# Altium project Receiver Board.PrjPCB
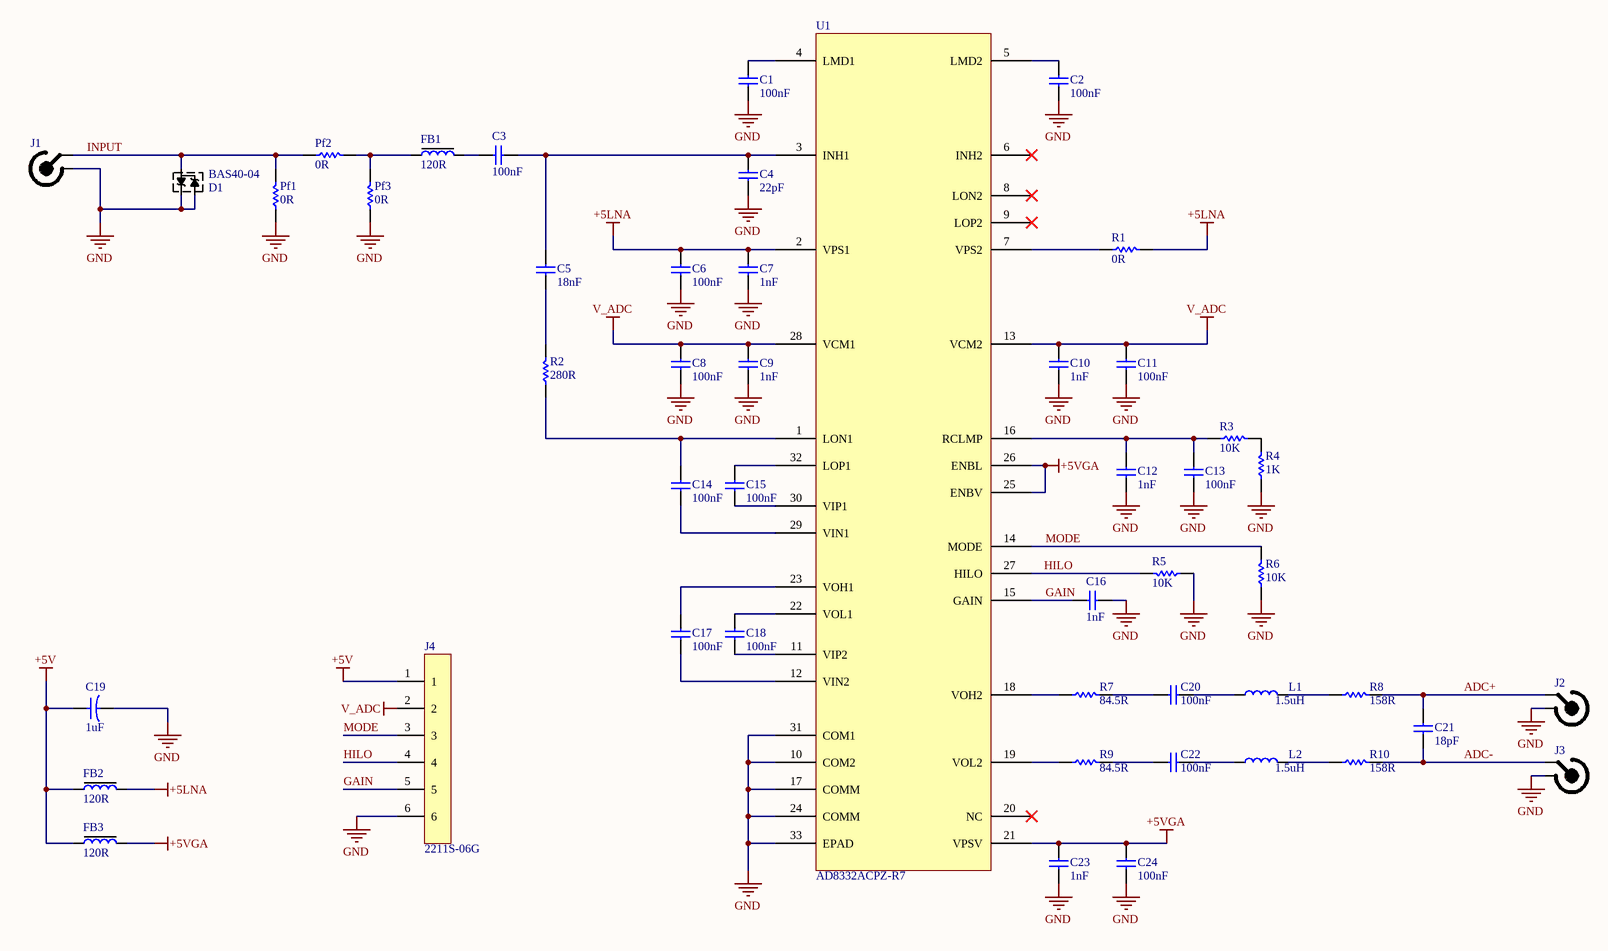
[diagram p0: Receiver.SchDoc]
1 sheet, 48 parts. Net scope: global (net labels, ports and power ports of the same name join across sheets).
Board file: Receiver.PcbDoc

## Sheet Receiver.SchDoc: AD8832 Test Board
size A3; Revision: 1.0; SheetNumber: 1; SheetTotal: 1

### Parts
C1  100nF  [CAP 0603/1608]
C2  100nF  [CAP 0603/1608]
C3  100nF  [CAP 0603/1608]
C4  22pF  [CAP 0603/1608]
C5  18nF  [CAP 0603/1608]
C6  100nF  [CAP 0603/1608]
C7  1nF  [CAP 0603/1608]
C8  100nF  [CAP 0603/1608]
C9  1nF  [CAP 0603/1608]
C10  1nF  [CAP 0603/1608]
C11  100nF  [CAP 0603/1608]
C12  1nF  [CAP 0603/1608]
C13  100nF  [CAP 0603/1608]
C14  100nF  [CAP 0603/1608]
C15  100nF  [CAP 0603/1608]
C16  1nF  [CAP 0603/1608]
C17  100nF  [CAP 0603/1608]
C18  100nF  [CAP 0603/1608]
C19  1uF  [CAP CASE A]
C20  100nF  [CAP 0603/1608]
C21  18pF  [CAP 0603/1608]
C22  100nF  [CAP 0603/1608]
C23  1nF  [CAP 0603/1608]
C24  100nF  [CAP 0603/1608]
D1  BAS40-04  [SOT-23-3]
FB1  120R  [FER 0805/2012]
FB2  120R  [FER 0805/2012]
FB3  120R  [FER 0805/2012]
J1  73251-1150  [73251-1150]  (value not drawn)
J2  73251-1150  [73251-1150]  (value not drawn)
J3  73251-1150  [73251-1150]  (value not drawn)
J4  2211S-06G  [HEADER 6-WAY 2.54 mm]
L1  1.5uH  [FER 0603/1608]
L2  1.5uH  [FER 0603/1608]
Pf1  0R  [RES 1206/3216]
Pf2  0R  [RES 1206/3216]
Pf3  0R  [RES 1206/3216]
R1  0R  [RES 0603/1608]
R2  280R  [RES 0603/1608]
R3  10K  [RES 0603/1608]
R4  1K  [RES 0603/1608]
R5  10K  [RES 0603/1608]
R6  10K  [RES 0603/1608]
R7  84.5R  [RES 0603/1608]
R8  158R  [RES 0603/1608]
R9  84.5R  [RES 0603/1608]
R10  158R  [RES 0603/1608]
U1  AD8332ACPZ-R7  [LFCSP-32]

### Nets
+5LNA: C6.1 C7.2 FB2.2 R1.2 U1.2(VPS1)
+5V: C19.1 FB2.1 FB3.1 J4.1
+5VGA: C23.2 C24.2 FB3.2 U1.21(VPSV) U1.25(ENBV) U1.26(ENBL)
GND: C1.1 C2.1 C4.1 C6.2 C7.1 C8.2 C9.1 C10.1 C11.2 C12.1 C13.1 C16.1 C19.2 C23.1 C24.1 D1.1 D1.2 J1.2 J2.2 J3.2 J4.6 Pf1.1 Pf3.1 R4.1 R5.1 R6.1 U1.10(COM2) U1.17(COMM) U1.24(COMM) U1.31(COM1) U1.33(EPAD)
V_ADC: C8.1 C9.2 C10.2 C11.1 J4.2 U1.13(VCM2) U1.28(VCM1)
ADC+: C21.2 J2.1 R8.2
ADC-: C21.1 J3.1 R10.2
GAIN: C16.2 J4.5 U1.15(GAIN)
HILO: J4.4 R5.2 U1.27(HILO)
INPUT: D1.3 J1.1 Pf1.2 Pf2.1
MODE: J4.3 R6.2 U1.14(MODE)
NetC1_2: C1.2 U1.4(LMD1)
NetC2_2: C2.2 U1.5(LMD2)
NetC3_1: C3.1 FB1.2
NetC3_2: C3.2 C4.2 C5.2 U1.3(INH1)
NetC5_1: C5.1 R2.2
NetC12_2: C12.2 C13.2 R3.1 U1.16(RCLMP)
NetC14_1: C14.1 U1.29(VIN1)
NetC14_2: C14.2 R2.1 U1.1(LON1)
NetC15_1: C15.1 U1.30(VIP1)
NetC15_2: C15.2 U1.32(LOP1)
NetC17_1: C17.1 U1.12(VIN2)
NetC17_2: C17.2 U1.23(VOH1)
NetC18_1: C18.1 U1.11(VIP2)
NetC18_2: C18.2 U1.22(VOL1)
NetC20_1: C20.1 R7.2
NetC20_2: C20.2 L1.1
NetC22_1: C22.1 R9.2
NetC22_2: C22.2 L2.1
NetFB1_1: FB1.1 Pf2.2 Pf3.2
NetL1_2: L1.2 R8.1
NetL2_2: L2.2 R10.1
NetR1_1: R1.1 U1.7(VPS2)
NetR3_2: R3.2 R4.2
NetR7_1: R7.1 U1.18(VOH2)
NetR9_1: R9.1 U1.19(VOL2)

Not connected (* = marked no-connect by the designer): U1 6(INH2)* 8(LON2)* 9(LOP2)* 20(NC)*

### Notes on the sheet
- Title:
- Size:
- Date:
- A4
- Revision:
- Sheet
- of
- File:

### Library data of the parts
C1-C3 C6 C8 C11 C13-C15 C17 C18 C20 C22 C24 = GCJ188R71H104KA12D: CAPACITOR 0603 100nF 10% 50V; Manufacturer: Murata; Dielectric: X7R; Supplier 1: Farnell; Manufacturer Part Number: GCJ188R71H104KA12D; Stock 1: 0; Pricing 1: 150=0.11, 500=0.066, 1000=0.055 (EUR); Mount: Surface Mount; Case/Package: 0603; Case Code (Metric): 1608; Case Code (Imperial): 0603; Min Operating Temperature: -55°C; Max Operating Temperature: 125°C; Capacitance: 100nF; Tolerance: 10%; Package Quantity: 1; Voltage Rating: 50V; Packaging: Tape and Reel; Voltage Rating (DC): 50V; Termination: SMD/SMT; Features: Soft Termination; Length: 1.6mm; Height: 0.8mm; Width: 0.031inch; Thickness: 0.035inch; Depth: 0.8mm; Ratings: AEC-Q200; Radiation Hardening: No; Lead Free: Lead Free; ComponentLink1URL: http://search.murata.co.jp/Ceramy/image/img/A01X/partnumbering_e_02.pdf?src-supplier=Digi-Key; ComponentLink1Description: http://search.murata.co.jp/Ceramy/image/img/A01X/partnumbering_e_02.pdf?src-supplier=Digi-Key; ComponentLink2URL: http://www.murata.com/products/catalog/pdf/c03e.pdf?src-supplier=Future+Electronics; ComponentLink2Description: http://www.murata.com/products/catalog/pdf/c03e.pdf?src-supplier=Future+Electronics; ComponentLink3URL: https://www.verical.com/server-webapp/html/getDatasheet?partID=369886&src-supplier=Verical; ComponentLink3Description: https://www.verical.com/server-webapp/html/getDatasheet?partID=369886&src-supplier=Verical
C4 = C1608C0G1H220J080AA: CAPACITOR 0603 22 pF 50 V  5%, C0G / NP0; Manufacturer: TDK; Dielectric Material: Ceramic; Voltage Rating: 50V; Temperature Coefficient: 30ppm/°C; Supplier 1: Farnell; Manufacturer Part Number: C1608C0G1H220J080AA; Stock 1: 0; Mount: Surface Mount; Case/Package: 0603; Number of Pins: 2; Case Code (Metric): 1608; Case Code (Imperial): 0603; Weight: 7.1E-05oz; Min Operating Temperature: -55°C; Max Operating Temperature: 125°C; Tolerance: 5%; Capacitance: 22pF; Dielectric: C0G; Packaging: Tape and Reel; Package Quantity: 1; Voltage Rating (DC): 50V; Termination: SMD/SMT; Voltage: 50V; Length: 1.6mm; Width: 0.031inch; Height: 0.8mm; Depth: 0.8mm; Thickness: 0.037inch; Radiation Hardening: No; REACH SVHC: Unknown; Lead Free: Lead Free; ComponentLink1URL: https://product.tdk.com/info/en/documents/chara_sheet/C1608C0G1H220J080AA.pdf?src-supplier=Digi-Key; ComponentLink1Description: https://product.tdk.com/info/en/documents/chara_sheet/C1608C0G1H220J080AA.pdf?src-supplier=Digi-Key; ComponentLink2URL: http://www.tdk.co.jp/tefe02/e412_c.pdf?src-supplier=Avnet+Europe; ComponentLink2Description: http://www.tdk.co.jp/tefe02/e412_c.pdf?src-supplier=Avnet+Europe; ComponentLink3URL: http://www.farnell.com/datasheets/1796654.pdf?src-supplier=Element14; ComponentLink3Description: http://www.farnell.com/datasheets/1796654.pdf?src-supplier=Element14; ComponentLink4URL: http://www.farnell.com/datasheets/1744655.pdf?src-supplier=Element14; ComponentLink4Description: http://www.farnell.com/datasheets/1744655.pdf?src-supplier=Element14; ComponentLink5URL: http://www.farnell.com/datasheets/1913358.pdf?src-supplier=Element14; ComponentLink5Description: http://www.farnell.com/datasheets/1913358.pdf?src-supplier=Element14; ComponentLink6URL: http://www.farnell.com/datasheets/2291921.pdf?src-supplier=Verical; ComponentLink6Description: http://www.farnell.com/datasheets/2291921.pdf?src-supplier=Verical
C5 = C1608C0G1V183J080AC: CAPACITOR 0603 18nF 35V NP0; Manufacturer: TDK; Dielectric Material: Ceramic; Tolerance: 5%; Supplier 1: Farnell; Manufacturer Part Number: C1608C0G1V183J080AC; Stock 1: 0; Pricing 1: 150=0.127, 500=0.0919, 1000=0.0807, 2000=0.0669, 4000=0.0576, 20000=0.0502 (EUR); Mount: Surface Mount; Case/Package: 0603; Case Code (Metric): 1608; Case Code (Imperial): 0603; Min Operating Temperature: -55°C; Max Operating Temperature: 125°C; Packaging: Tape and Reel; Capacitance: 18nF; Voltage Rating: 35V; Voltage Rating (DC): 35V; Length: 0.063inch; Width: 0.031inch; Thickness: 0.035inch; Lead Free: Lead Free; ComponentLink1URL: https://product.tdk.com/info/en/catalog/spec/mlccspec_commercial_general_midvoltage_en.pdf?src-supplier=Digi-Key; ComponentLink1Description: https://product.tdk.com/info/en/catalog/spec/mlccspec_commercial_general_midvoltage_en.pdf?src-supplier=Digi-Key
C7 C9 C10 C12 C16 C23 = GRM1885C2A102JA01D: CAPACITOR 0603 1nF 100V C0G/NP0; Manufacturer: Murata; Material: Ceramic; Tolerance: 5%; Dielectric: C0G; Temperature Coefficient: 30ppm/°C; Supplier 1: Farnell; Manufacturer Part Number: GRM1885C2A102JA01D; Stock 1: 0; Pricing 1: 4000=0.0144, 20000=0.0141 (EUR); Mount: Surface Mount; Case/Package: 0603; Case Code (Imperial): 0603; Case Code (Metric): 1608; Min Operating Temperature: -55°C; Max Operating Temperature: 125°C; Capacitance: 1nF; Packaging: Tape and Reel; Voltage Rating: 100V; Package Quantity: 1; Termination: SMD/SMT; Voltage: 100V; Voltage Rating (DC): 100V; Length: 1.6mm; Width: 0.031inch; Height: 0.8mm; Thickness: 0.035inch; Depth: 0.8mm; Radiation Hardening: No; REACH SVHC: No SVHC; Lead Free: Lead Free; ComponentLink1URL: http://psearch.murata.com/capacitor/product/GRM1885C2A102JA01%23.pdf?src-supplier=Future+Electronics; ComponentLink1Description: http://psearch.murata.com/capacitor/product/GRM1885C2A102JA01%23.pdf?src-supplier=Future+Electronics; ComponentLink2URL: http://components.arrow.com/part/dataview/41890575S7256258N2606?src-supplier=Arrow+Electronics; ComponentLink2Description: http://components.arrow.com/part/dataview/41890575S7256258N2606?src-supplier=Arrow+Electronics; ComponentLink3URL: http://www.mouser.com/ds/2/281/c02e-2905.pdf?src-supplier=Mouser; ComponentLink3Description: http://www.mouser.com/ds/2/281/c02e-2905.pdf?src-supplier=Mouser; ComponentLink4URL: https://www.murata.com/~/media/webrenewal/support/library/catalog/products/capacitor/mlcc/c02e.ashx?la=en-us&src-supplier=Digi-Key; ComponentLink4Description: https://www.murata.com/~/media/webrenewal/support/library/catalog/products/capacitor/mlcc/c02e.ashx?la=en-us&src-supplier=Digi-Key; ComponentLink5URL: https://produktinfo.conrad.com/datenblaetter/450000-474999/451233-da-01-en-VS_KONDENSATOR_0603.pdf?src-supplier=Conrad; ComponentLink5Description: https://produktinfo.conrad.com/datenblaetter/450000-474999/451233-da-01-en-VS_KONDENSATOR_0603.pdf?src-supplier=Conrad
C19 = T491A105K016AT: CAPACITOR TANT 1uF 16V; Manufacturer: KEMET; Dielectric Material: Tantalum; Tolerance: 20%; ESR (Equivalent Series Resistance): 10R; Polarity: Polar; Dissipation Factor: 4%; Life (Hours): 2000Hour; Leakage Current: 500nA; Ripple Current: 87mA; Supplier 1: Farnell; Manufacturer Part Number: T491A105K016AT; Stock 1: 0; Mount: Surface Mount,PCB; Case/Package: 1206; Number of Pins: 2; Case Code (Imperial): 1206; Case Code (Metric): 3216; Min Operating Temperature: -55°C; Max Operating Temperature: 125°C; Capacitance: 1uF; Packaging: Tape and Reel; Voltage Rating: 16V; Package Quantity: 1; Features: General Purpose; Voltage Rating (DC): 16V; Termination: SMD/SMT; Voltage: 16V; Length: 3.2mm; Width: 1.6mm; Height: 1.6mm; Depth: 1.6mm; Height - Seated (Max): 0.071inch; REACH SVHC: No SVHC; Lead Free: Lead Free; ComponentLink1URL: https://4donline.ihs.com/images/VipMasterIC/IC/KEME/KEME-S-A0006487387/KEME-S-A0006487387-1.pdf?hkey=52A5661711E402568146F3353EA87419&src-supplier=Element14; ComponentLink1Description: https://4donline.ihs.com/images/VipMasterIC/IC/KEME/KEME-S-A0006487387/KEME-S-A0006487387-1.pdf?hkey=52A5661711E402568146F3353EA87419&src-supplier=Element14; ComponentLink2URL: http://www.rapidonline.com/pdf/458280_da_en_01.pdf?src-supplier=Rapid+Electronics; ComponentLink2Description: http://www.rapidonline.com/pdf/458280_da_en_01.pdf?src-supplier=Rapid+Electronics; ComponentLink3URL: http://www.jameco.com/Jameco/Products/ProdDS/1573169.pdf?src-supplier=Jameco; ComponentLink3Description: http://www.jameco.com/Jameco/Products/ProdDS/1573169.pdf?src-supplier=Jameco; ComponentLink4URL: http://www.kemet.com/kemet/web/homepage/kechome.nsf/file/T491%20Series/$file/KEM_T2005_T491.pdf?src-supplier=Farnell; ComponentLink4Description: http://www.kemet.com/kemet/web/homepage/kechome.nsf/file/T491%20Series/$file/KEM_T2005_T491.pdf?src-supplier=Farnell; ComponentLink5URL: http://www.mouser.com/ds/2/212/KEM_T2005_T491-1093550.pdf?src-supplier=Mouser; ComponentLink5Description: http://www.mouser.com/ds/2/212/KEM_T2005_T491-1093550.pdf?src-supplier=Mouser; ComponentLink6URL: https://www.distrelec.biz/Web/Downloads/_t/ds/KEM_T2005_T491_eng_tds.pdf?mime=application%2Fpdf&src-supplier=Distrelec; ComponentLink6Description: https://www.distrelec.biz/Web/Downloads/_t/ds/KEM_T2005_T491_eng_tds.pdf?mime=application%2Fpdf&src-supplier=Distrelec; ComponentLink7URL: https://api.kemet.com/component-edge/download/datasheet/T491A105K016AT.pdf?src-supplier=Digi-Key; ComponentLink7Description: https://api.kemet.com/component-edge/download/datasheet/T491A105K016AT.pdf?src-supplier=Digi-Key; ComponentLink8URL: http://www.kemet.com/kemet/web/homepage/kechome.nsf/file/T491%20Series/$file/KEM_T2005_T491.pdf?src-supplier=Element14; ComponentLink8Description: http://www.kemet.com/kemet/web/homepage/kechome.nsf/file/T491%20Series/$file/KEM_T2005_T491.pdf?src-supplier=Element14; ComponentLink9URL: http://uk.rs-online.com/webdocs/1529/0900766b815290c9.pdf?src-supplier=RSComponents; ComponentLink9Description: http://uk.rs-online.com/webdocs/1529/0900766b815290c9.pdf?src-supplier=RSComponents; ComponentLink10URL: https://www.alliedelec.com/m/d/1172a60f7bb3eb66344f86e8fb9ddbde.pdf?src-supplier=Allied+Electronics; ComponentLink10Description: https://www.alliedelec.com/m/d/1172a60f7bb3eb66344f86e8fb9ddbde.pdf?src-supplier=Allied+Electronics
C21 = C1608C0G1H180J080AA: CAPACITOR 0603 18pF 50V C0G; Manufacturer: TDK; Dielectric Material: Ceramic; Tolerance: 5%; Temperature Coefficient: 30ppm/°C; Supplier 1: Farnell; Manufacturer Part Number: C1608C0G1H180J080AA; Stock 1: 0; Mount: Surface Mount; Case/Package: 0603; Number of Pins: 2; Case Code (Metric): 1608; Case Code (Imperial): 0603; Weight: 7.1E-05oz; Min Operating Temperature: -55°C; Max Operating Temperature: 125°C; Capacitance: 18pF; Dielectric: C0G; Voltage Rating: 50V; Package Quantity: 1; Packaging: Tape and Reel; Voltage Rating (DC): 50V; Termination: SMD/SMT; Voltage: 50V; Length: 1.6mm; Width: 0.031inch; Height: 0.8mm; Depth: 0.8mm; Thickness: 0.037inch; Radiation Hardening: No; REACH SVHC: No SVHC; Lead Free: Lead Free; ComponentLink1URL: http://www.farnell.com/datasheets/1796654.pdf?src-supplier=Element14; ComponentLink1Description: http://www.farnell.com/datasheets/1796654.pdf?src-supplier=Element14; ComponentLink2URL: http://www.farnell.com/datasheets/1571323.pdf?src-supplier=Element14; ComponentLink2Description: http://www.farnell.com/datasheets/1571323.pdf?src-supplier=Element14; ComponentLink3URL: http://www.farnell.com/datasheets/1571323.pdf?src-supplier=Farnell; ComponentLink3Description: http://www.farnell.com/datasheets/1571323.pdf?src-supplier=Farnell; ComponentLink4URL: http://www.farnell.com/datasheets/1744655.pdf?src-supplier=Element14; ComponentLink4Description: http://www.farnell.com/datasheets/1744655.pdf?src-supplier=Element14; ComponentLink5URL: https://product.tdk.com/info/en/documents/chara_sheet/C1608C0G1H180J080AA.pdf?src-supplier=Digi-Key; ComponentLink5Description: https://product.tdk.com/info/en/documents/chara_sheet/C1608C0G1H180J080AA.pdf?src-supplier=Digi-Key; ComponentLink6URL: http://www.tdk.co.jp/tefe02/e412_c.pdf?src-supplier=Avnet+Europe; ComponentLink6Description: http://www.tdk.co.jp/tefe02/e412_c.pdf?src-supplier=Avnet+Europe
D1 = BAS40-04: SCHOTTKY DIODE; Manufacturer: Infineon; Forward Current: 120mA; Max Repetitive Reverse Voltage (Vrrm): 40V; Forward Voltage: 380mV; Max Forward Surge Current (Ifsm): 200mA; Element Configuration: Dual; Supplier 1: Farnell; Manufacturer Part Number: BAS40-04; Stock 1: 0; Case/Package: SOT; Number of Pins: 3; Min Operating Temperature: -55°C; Max Operating Temperature: 125°C; Packaging: Tape and Reel; Termination: SMD/SMT; REACH SVHC: No SVHC; ComponentLink1URL: https://www.distrelec.biz/Web/Downloads/ta/_e/srBAS40_data_e.pdf?mime=application%2Fpdf&src-supplier=Distrelec; ComponentLink1Description: https://www.distrelec.biz/Web/Downloads/ta/_e/srBAS40_data_e.pdf?mime=application%2Fpdf&src-supplier=Distrelec
FB1-FB3 = BLM21PG121SN1D: FERRITE BEAD 120Ohm 3A; Manufacturer: Murata; Material: Steel,Ferrite; DC Resistance (DCR): 30mR; Number of Lines: 1; Tolerance: 25%; Test Frequency: 100MHz; Supplier 1: Farnell; Manufacturer Part Number: BLM21PG121SN1D; Stock 1: 0; Case/Package: 0805; Number of Pins: 2; Case Code (Metric): 2012; Case Code (Imperial): 0805; Min Operating Temperature: -55°C; Max Operating Temperature: 125°C; Impedance: 120R; Packaging: Tape and Reel; Current Rating: 3A; Number of Circuits: 1; Package Quantity: 1; Max Current Rating: 3A; Max DC Current: 3A; Termination: SMD/SMT; Length: 2mm; Height: 0.85mm; Width: 1.25mm; Depth: 1.25mm; REACH SVHC: No SVHC; Lead Free: Lead Free; ComponentLink1URL: http://search.murata.co.jp/Ceramy/image/img/PDF/ENG/L0110S0100BLM21P.pdf?src-supplier=Future+Electronics; ComponentLink1Description: http://search.murata.co.jp/Ceramy/image/img/PDF/ENG/L0110S0100BLM21P.pdf?src-supplier=Future+Electronics; ComponentLink2URL: https://www.murata.com/en-us/products/productdata/8796738977822/ENFA0005.pdf?src-supplier=Digi-Key; ComponentLink2Description: https://www.murata.com/en-us/products/productdata/8796738977822/ENFA0005.pdf?src-supplier=Digi-Key; ComponentLink3URL: http://www.farnell.com/datasheets/1756152.pdf?src-supplier=Element14; ComponentLink3Description: http://www.farnell.com/datasheets/1756152.pdf?src-supplier=Element14
J1-J3 = 73251-1150: CONN SMA RCPT STR 50OHM EDGE MNT; Manufacturer: Molex; Body Material: Brass; Body Plating: Gold; Dielectric Material: PTFE; Impedance: 50R; Connector Type: SMA,Socket; Max Frequency: 18GHz; Voltage Rating: 500V; Supplier 1: Farnell; Manufacturer Part Number: 73251-1150; Stock 1: 0; Mount: Edge; Case/Package: SMA; Contact Plating: Gold; Contact Material: Copper; Insulation Material: Polytetrafluoroethylene; Housing Color: Gold; Min Operating Temperature: -65°C; Max Operating Temperature: 165°C; Termination: Solder; Packaging: Tray; Package Quantity: 1600; Fastening Type: Threaded; Length: 9.53mm; Depth: 9.53mm; Radiation Hardening: No; Lead Free: Lead Free; ComponentLink1URL: http://www.farnell.com/datasheets/1596721.pdf?src-supplier=Farnell; ComponentLink1Description: http://www.farnell.com/datasheets/1596721.pdf?src-supplier=Farnell; ComponentLink2URL: http://www.molex.com/webdocs/datasheets/pdf/en-us/0732511150_RF_COAX_CONNECTORS.pdf?src-supplier=Avnet; ComponentLink2Description: http://www.molex.com/webdocs/datasheets/pdf/en-us/0732511150_RF_COAX_CONNECTORS.pdf?src-supplier=Avnet; ComponentLink3URL: https://www.molex.com/pdm_docs/ps/PS-89675-346.pdf?src-supplier=Digi-Key; ComponentLink3Description: https://www.molex.com/pdm_docs/ps/PS-89675-346.pdf?src-supplier=Digi-Key; ComponentLink4URL: http://www.onlinecomponents.com/productFiles/mf-MOL/473370732511150_rf_coax_nectors.pdf?src-supplier=Onlinecomponents.com; ComponentLink4Description: http://www.onlinecomponents.com/productFiles/mf-MOL/473370732511150_rf_coax_nectors.pdf?src-supplier=Onlinecomponents.com; ComponentLink5URL: http://www.farnell.com/datasheets/1596721.pdf?src-supplier=Element14; ComponentLink5Description: http://www.farnell.com/datasheets/1596721.pdf?src-supplier=Element14; ComponentLink6URL: http://uk.rs-online.com/webdocs/13c4/0900766b813c49cf.pdf?src-supplier=RSComponents; ComponentLink6Description: http://uk.rs-online.com/webdocs/13c4/0900766b813c49cf.pdf?src-supplier=RSComponents
J4 = 2211S-06G: HEADER 6-Way 2.54mm TH; Manufacturer: Multicomp; Number of Contacts: 6; Gender: Male; Insulation Resistance: 1GR; Supplier 1: Farnell; Manufacturer Part Number: 2211S-06G; Stock 1: 35965; Pricing 1: 50=0.0344, 500=0.0253, 1500=0.0218, 2500=0.0179 (EUR); Mount: Through Hole; Contact Plating: Gold; Contact Material: Copper Alloy; Weight: 0.11lb; Number of Rows: 1; Termination: Through Hole; Length: 0.59inch; Width: 0.12inch; Height: 0.47inch; Flammability Rating: UL94 V-0; REACH SVHC: No SVHC; ComponentLink1URL: http://www.farnell.com/datasheets/1518407.pdf?src-supplier=Element14; ComponentLink1Description: http://www.farnell.com/datasheets/1518407.pdf?src-supplier=Element14
L1 L2 = MLF1608A1R5K: INDUCTOR 0603 1.5uH 10%; Manufacturer: TDK; Core Material: Ferrite; Max DC Current: 50mA; DC Resistance (DCR): 700mR; Self Resonant Frequency: 100MHz; Shielding: Shielded; Test Frequency: 10MHz; Q Factor: 35; Supplier 1: Farnell; Manufacturer Part Number: MLF1608A1R5K; Stock 1: 0; Pricing 1: 150=0.141, 500=0.0877, 1000=0.0765, 2000=0.075, 4000=0.0735, 20000=0.072 (EUR); Mount: Surface Mount; Case/Package: 0603; Number of Pins: 2; Case Code (Metric): 1608; Case Code (Imperial): 0603; Weight: 0.000141oz; Min Operating Temperature: -40°C; Max Operating Temperature: 85°C; Tolerance: 10%; Inductance: 1.5uH; Packaging: Tape and Reel; Package Quantity: 4000; Current Rating: 50mA; Termination: SMD/SMT; DC Current: 50mA; Inductance Tolerance: 10%; Length: 0.063inch; Width: 0.8mm; Height: 0.8mm; Depth: 0.95mm; Military Standard: Not; REACH SVHC: No SVHC; Lead Free: Lead Free; ComponentLink1URL: http://www.farnell.com/datasheets/321058.pdf?src-supplier=Element14; ComponentLink1Description: http://www.farnell.com/datasheets/321058.pdf?src-supplier=Element14
Pf1-Pf3 = ERJ8GEY0R00V: RESISTOR 1206 0R; Manufacturer: Panasonic; Power Rating: 250mW; Voltage Rating: 200V; Tolerance: 0.05%; Temperature Coefficient: 600ppm/°C; Supplier 1: Farnell; Manufacturer Part Number: ERJ8GEY0R00V; Stock 1: 0; Mount: Surface Mount; Case/Package: 1206; Contact Plating: Tin; Case Code (Metric): 3216; Case Code (Imperial): 1206; Min Operating Temperature: -55°C; Max Operating Temperature: 155°C; Resistance: 0R; Resistor Type: Thick Film; Packaging: Tape and Reel; Voltage Rating (DC): 200V; Package Quantity: 5000; Number of Terminations: 2; Termination: SMD/SMT; Max Power Dissipation: 250mW; Features: Automotive AEC-Q200; Length: 3.2mm; Width: 0.063inch; Height: 0.028inch; Depth: 1.6mm; Radiation Hardening: No; REACH SVHC: No SVHC; Military Standard: Not; Lead Free: Lead Free; ComponentLink1URL: http://industrial.panasonic.com/cdbs/www-data/pdf/RDA0000/AOA0000C301.pdf?src-supplier=Element14; ComponentLink1Description: http://industrial.panasonic.com/cdbs/www-data/pdf/RDA0000/AOA0000C301.pdf?src-supplier=Element14; ComponentLink2URL: http://www.farnell.com/datasheets/1678796.pdf?src-supplier=Element14; ComponentLink2Description: http://www.farnell.com/datasheets/1678796.pdf?src-supplier=Element14; ComponentLink3URL: http://www.jameco.com/Jameco/Products/ProdDS/1990261.pdf?src-supplier=Jameco; ComponentLink3Description: http://www.jameco.com/Jameco/Products/ProdDS/1990261.pdf?src-supplier=Jameco; ComponentLink4URL: http://industrial.panasonic.com/www-data/pdf/AOA0000/AOA0000CE1.pdf?src-supplier=Future+Electronics; ComponentLink4Description: http://industrial.panasonic.com/www-data/pdf/AOA0000/AOA0000CE1.pdf?src-supplier=Future+Electronics
R1 = ERJ3GEY0R00V: RESISTOR 0603 0R; Manufacturer: Panasonic; Manufacturer Part Number: ERJ-3GEY0R00V; Power Rating: 100mW; Voltage Rating: 75V; Tolerance: 0%; Temperature Coefficient: 600ppm/°C; Voltage Rating (DC): 50V; Supplier 1: Farnell; Stock 1: 0; Mount: Surface Mount; Case/Package: 0603; Contact Plating: Tin; Case Code (Metric): 1608; Case Code (Imperial): 0603; Min Operating Temperature: -55°C; Max Operating Temperature: 155°C; Resistance: 0R; Resistor Type: Thick Film; Packaging: Tape and Reel; Package Quantity: 1; Number of Terminations: 2; Termination: SMD/SMT; Max Power Dissipation: 100mW; Features: Automotive AEC-Q200; Length: 1.6mm; Width: 0.031inch; Height: 0.45mm; Depth: 0.8mm; Radiation Hardening: No; REACH SVHC: No SVHC; Military Standard: Not; Lead Free: Lead Free; ComponentLink1URL: http://industrial.panasonic.com/www-data/pdf/AOA0000/AOA0000CE1.pdf?src-supplier=Avnet; ComponentLink1Description: http://industrial.panasonic.com/www-data/pdf/AOA0000/AOA0000CE1.pdf?src-supplier=Avnet; ComponentLink2URL: http://industrial.panasonic.com/cdbs/www-data/pdf/RDA0000/AOA0000C301.pdf?src-supplier=Farnell; ComponentLink2Description: http://industrial.panasonic.com/cdbs/www-data/pdf/RDA0000/AOA0000C301.pdf?src-supplier=Farnell; ComponentLink3URL: http://www.jameco.com/Jameco/Products/ProdDS/1935748.pdf?src-supplier=Jameco; ComponentLink3Description: http://www.jameco.com/Jameco/Products/ProdDS/1935748.pdf?src-supplier=Jameco; ComponentLink4URL: http://www.farnell.com/datasheets/1678796.pdf?src-supplier=Element14; ComponentLink4Description: http://www.farnell.com/datasheets/1678796.pdf?src-supplier=Element14; ComponentLink5URL: http://industrial.panasonic.com/www-data/pdf/AOA0000/AOA0000CE1.pdf?src-supplier=Future+Electronics; ComponentLink5Description: http://industrial.panasonic.com/www-data/pdf/AOA0000/AOA0000CE1.pdf?src-supplier=Future+Electronics; ComponentLink6URL: http://industrial.panasonic.com/www-data/pdf/AOA0000/AOA0000CE1.pdf?src-supplier=Avnet+Europe; ComponentLink6Description: http://industrial.panasonic.com/www-data/pdf/AOA0000/AOA0000CE1.pdf?src-supplier=Avnet+Europe; ComponentLink7URL: http://www.alliedelec.com/m/d/51cd0790071e1666bdb9d00c57fcf960.pdf?src-supplier=Allied+Electronics; ComponentLink7Description: http://www.alliedelec.com/m/d/51cd0790071e1666bdb9d00c57fcf960.pdf?src-supplier=Allied+Electronics
R2 = ERJ3EKF2800V: RESISTOR 0603 280R 1%; Manufacturer: Panasonic; Manufacturer Part Number: ERJ-3EKF2800V; Power Rating: 100mW; Voltage Rating: 75V; Temperature Coefficient: 100ppm/°C; Voltage Rating (DC): 50V; Supplier 1: Farnell; Stock 1: 0; Mount: Surface Mount; Case/Package: 0603; Case Code (Metric): 1608; Case Code (Imperial): 0603; Weight: 7.1E-05oz; Contact Plating: Tin; Min Operating Temperature: -55°C; Max Operating Temperature: 155°C; Resistance: 280R; Tolerance: 1%; Packaging: Cut Tape; Package Quantity: 1; Resistor Type: Thick Film; Number of Terminations: 2; Termination: SMD/SMT; Max Power Dissipation: 100mW; Features: Automotive AEC-Q200; Length: 1.6mm; Width: 0.031inch; Height: 0.45mm; Depth: 0.8mm; Radiation Hardening: No; REACH SVHC: No SVHC; Military Standard: Not; Lead Free: Lead Free; ComponentLink1URL: http://www.mouser.com/ds/2/315/AOA0000C304-1149620.pdf?src-supplier=Mouser; ComponentLink1Description: http://www.mouser.com/ds/2/315/AOA0000C304-1149620.pdf?src-supplier=Mouser; ComponentLink2URL: http://www.farnell.com/datasheets/1911175.pdf?src-supplier=Farnell; ComponentLink2Description: http://www.farnell.com/datasheets/1911175.pdf?src-supplier=Farnell; ComponentLink3URL: http://industrial.panasonic.com/www-data/pdf/AOA0000/AOA0000CE2.pdf?src-supplier=Avnet; ComponentLink3Description: http://industrial.panasonic.com/www-data/pdf/AOA0000/AOA0000CE2.pdf?src-supplier=Avnet; ComponentLink4URL: https://www.alliedelec.com/m/d/623f45ff1957d936ff56d46fd1c28cac.pdf?src-supplier=Allied+Electronics; ComponentLink4Description: https://www.alliedelec.com/m/d/623f45ff1957d936ff56d46fd1c28cac.pdf?src-supplier=Allied+Electronics; ComponentLink5URL: http://www.farnell.com/datasheets/1678782.pdf?src-supplier=Element14; ComponentLink5Description: http://www.farnell.com/datasheets/1678782.pdf?src-supplier=Element14; ComponentLink6URL: http://www.farnell.com/datasheets/1911175.pdf?src-supplier=Element14; ComponentLink6Description: http://www.farnell.com/datasheets/1911175.pdf?src-supplier=Element14
R3 R5 R6 = ERJ3EKF1002V: RESISTOR 0603 10K 1%; Manufacturer: Panasonic; Temperature Coefficient: 100ppm/°C; Power Rating: 100mW; Voltage Rating: 75V; Supplier 1: Farnell; Manufacturer Part Number: ERJ3EKF1002V; Stock 1: 0; Mount: Surface Mount; Case/Package: 0603; Number of Pins: 2; Contact Plating: Tin; Case Code (Metric): 1608; Case Code (Imperial): 0603; Min Operating Temperature: -55°C; Max Operating Temperature: 155°C; Resistance: 10K; Tolerance: 1%; Composition: Thick Film; Packaging: Tape and Reel; Package Quantity: 1; Number of Terminations: 2; Termination: SMD/SMT; Military Standard: Not; Max Power Dissipation: 100mW; Voltage Rating (DC): 75V; Features: Automotive AEC-Q200; Length: 1.6mm; Height: 0.45mm; Width: 0.031inch; Depth: 0.8mm; Radiation Hardening: No; REACH SVHC: No SVHC; Lead Free: Lead Free; ComponentLink1URL: https://industrial.panasonic.com/cdbs/www-data/pdf/RDA0000/DMA0000COL11.pdf?src-supplier=Avnet+Asia; ComponentLink1Description: https://industrial.panasonic.com/cdbs/www-data/pdf/RDA0000/DMA0000COL11.pdf?src-supplier=Avnet+Asia; ComponentLink2URL: http://www.farnell.com/datasheets/1911175.pdf?src-supplier=Element14; ComponentLink2Description: http://www.farnell.com/datasheets/1911175.pdf?src-supplier=Element14; ComponentLink3URL: https://industrial.panasonic.com/cdbs/www-data/pdf/RDA0000/DMA0000COL11.pdf?src-supplier=Avnet; ComponentLink3Description: https://industrial.panasonic.com/cdbs/www-data/pdf/RDA0000/DMA0000COL11.pdf?src-supplier=Avnet; ComponentLink4URL: http://industrial.panasonic.com/www-data/pdf/AOA0000/AOA0000CE2.pdf?src-supplier=Avnet+Europe; ComponentLink4Description: http://industrial.panasonic.com/www-data/pdf/AOA0000/AOA0000CE2.pdf?src-supplier=Avnet+Europe; ComponentLink5URL: http://industrial.panasonic.com/www-data/pdf/AOA0000/AOA0000CE2.pdf?src-supplier=Avnet; ComponentLink5Description: http://industrial.panasonic.com/www-data/pdf/AOA0000/AOA0000CE2.pdf?src-supplier=Avnet; ComponentLink6URL: https://industrial.panasonic.com/cdbs/www-data/pdf/RDA0000/DMA0000COL11.pdf?src-supplier=Mouser; ComponentLink6Description: https://industrial.panasonic.com/cdbs/www-data/pdf/RDA0000/DMA0000COL11.pdf?src-supplier=Mouser; ComponentLink7URL: https://industrial.panasonic.com/cdbs/www-data/pdf/RDA0000/DMA0000COL11.pdf?src-supplier=Allied+Electronics; ComponentLink7Description: https://industrial.panasonic.com/cdbs/www-data/pdf/RDA0000/DMA0000COL11.pdf?src-supplier=Allied+Electronics
R4 = ERJ3EKF1001V: RESISTOR 0603 1K 1%; Manufacturer: Panasonic; Temperature Coefficient: 100ppm/°C; Power Rating: 100mW; Voltage Rating: 75V; Supplier 1: Farnell; Manufacturer Part Number: ERJ3EKF1001V; Stock 1: 0; Mount: Surface Mount; Case/Package: 0603; Number of Pins: 2; Contact Plating: Tin; Case Code (Metric): 1608; Case Code (Imperial): 0603; Min Operating Temperature: -55°C; Max Operating Temperature: 155°C; Resistance: 1K; Tolerance: 1%; Composition: Thick Film; Packaging: Tape and Reel; Package Quantity: 5000; Number of Terminations: 2; Termination: SMD/SMT; Military Standard: Not; Max Power Dissipation: 100mW; Voltage Rating (DC): 75V; Features: Automotive AEC-Q200; Length: 1.6mm; Height: 0.45mm; Width: 0.8mm; Depth: 0.8mm; Radiation Hardening: No; REACH SVHC: No SVHC; Lead Free: Lead Free; ComponentLink1URL: http://www.farnell.com/datasheets/1911175.pdf?src-supplier=Allied+Electronics; ComponentLink1Description: http://www.farnell.com/datasheets/1911175.pdf?src-supplier=Allied+Electronics; ComponentLink2URL: http://industrial.panasonic.com/www-data/pdf/AOA0000/AOA0000CE2.pdf?src-supplier=Future+Electronics; ComponentLink2Description: http://industrial.panasonic.com/www-data/pdf/AOA0000/AOA0000CE2.pdf?src-supplier=Future+Electronics; ComponentLink3URL: http://industrial.panasonic.com/www-data/pdf/AOA0000/AOA0000CE2.pdf?src-supplier=Element14; ComponentLink3Description: http://industrial.panasonic.com/www-data/pdf/AOA0000/AOA0000CE2.pdf?src-supplier=Element14; ComponentLink4URL: http://industrial.panasonic.com/www-data/pdf/AOA0000/AOA0000CE2.pdf?src-supplier=Avnet; ComponentLink4Description: http://industrial.panasonic.com/www-data/pdf/AOA0000/AOA0000CE2.pdf?src-supplier=Avnet; ComponentLink5URL: http://industrial.panasonic.com/cdbs/www-data/pdf/RDA0000/AOA0000C304.pdf?src-supplier=Element14; ComponentLink5Description: http://industrial.panasonic.com/cdbs/www-data/pdf/RDA0000/AOA0000C304.pdf?src-supplier=Element14; ComponentLink6URL: http://www.mouser.com/ds/2/315/AOA0000CE2-37512.pdf?src-supplier=Mouser; ComponentLink6Description: http://www.mouser.com/ds/2/315/AOA0000CE2-37512.pdf?src-supplier=Mouser; ComponentLink7URL: http://www.farnell.com/datasheets/1678782.pdf?src-supplier=Element14; ComponentLink7Description: http://www.farnell.com/datasheets/1678782.pdf?src-supplier=Element14; ComponentLink8URL: http://industrial.panasonic.com/www-data/pdf/AOA0000/AOA0000CE2.pdf?src-supplier=Avnet+Europe; ComponentLink8Description: http://industrial.panasonic.com/www-data/pdf/AOA0000/AOA0000CE2.pdf?src-supplier=Avnet+Europe
R7 R9 = ERJ3EKF84R5V: RESISTOR 0603 84R5 1%; Manufacturer: Panasonic; Manufacturer Part Number: ERJ-3EKF84R5V; Voltage Rating: 75V; Power Rating: 100mW; Temperature Coefficient: 100ppm/°C; Voltage Rating (DC): 50V; Supplier 1: Farnell; Stock 1: 0; Mount: Surface Mount; Case/Package: 0603; Case Code (Metric): 1608; Case Code (Imperial): 0603; Contact Plating: Tin; Min Operating Temperature: -55°C; Max Operating Temperature: 155°C; Packaging: Tape and Reel; Resistance: 84.5R; Tolerance: 1%; Package Quantity: 1; Resistor Type: Thick Film; Number of Terminations: 2; Max Power Dissipation: 100mW; Features: Automotive AEC-Q200; Length: 1.6mm; Width: 0.031inch; Height: 0.022inch; Depth: 0.8mm; REACH SVHC: No SVHC; Military Standard: Not; Lead Free: Lead Free; ComponentLink1URL: http://www.farnell.com/datasheets/1678782.pdf?src-supplier=Farnell; ComponentLink1Description: http://www.farnell.com/datasheets/1678782.pdf?src-supplier=Farnell; ComponentLink2URL: http://www.farnell.com/datasheets/1678782.pdf?src-supplier=Element14; ComponentLink2Description: http://www.farnell.com/datasheets/1678782.pdf?src-supplier=Element14; ComponentLink3URL: http://www.mouser.com/ds/2/315/AOA0000C283-1093288.pdf?src-supplier=Mouser; ComponentLink3Description: http://www.mouser.com/ds/2/315/AOA0000C283-1093288.pdf?src-supplier=Mouser; ComponentLink4URL: http://industrial.panasonic.com/www-data/pdf/AOA0000/AOA0000CE2.pdf?src-supplier=Avnet; ComponentLink4Description: http://industrial.panasonic.com/www-data/pdf/AOA0000/AOA0000CE2.pdf?src-supplier=Avnet
R8 R10 = ERJ3EKF1580V: RESISTOR 0603 158R 1%; Manufacturer: Panasonic; Manufacturer Part Number: ERJ-3EKF1580V; Power Rating: 100mW; Voltage Rating: 75V; Temperature Coefficient: 100ppm/°C; Voltage Rating (DC): 50V; Supplier 1: Farnell; Stock 1: 0; Mount: Surface Mount; Case/Package: 0603; Case Code (Metric): 1608; Case Code (Imperial): 0603; Contact Plating: Tin; Min Operating Temperature: -55°C; Max Operating Temperature: 155°C; Resistance: 158R; Tolerance: 1%; Packaging: Tape and Reel; Package Quantity: 1; Resistor Type: Thick Film; Number of Terminations: 2; Max Power Dissipation: 100mW; Features: Automotive AEC-Q200; Length: 1.6mm; Width: 0.031inch; Height: 0.022inch; Depth: 0.8mm; REACH SVHC: Yes; Military Standard: Not; Lead Free: Lead Free; ComponentLink1URL: http://www.farnell.com/datasheets/1678782.pdf?src-supplier=Element14; ComponentLink1Description: http://www.farnell.com/datasheets/1678782.pdf?src-supplier=Element14; ComponentLink2URL: http://industrial.panasonic.com/www-data/pdf/AOA0000/AOA0000CE2.pdf?src-supplier=Avnet; ComponentLink2Description: http://industrial.panasonic.com/www-data/pdf/AOA0000/AOA0000CE2.pdf?src-supplier=Avnet; ComponentLink3URL: http://www.farnell.com/datasheets/1678782.pdf?src-supplier=Farnell; ComponentLink3Description: http://www.farnell.com/datasheets/1678782.pdf?src-supplier=Farnell; ComponentLink4URL: http://www.mouser.com/ds/2/315/AOA0000C283-1093288.pdf?src-supplier=Mouser; ComponentLink4Description: http://www.mouser.com/ds/2/315/AOA0000C283-1093288.pdf?src-supplier=Mouser
U1 = AD8332ACPZ-R7: 2-CHAN VGA 32LFCSP; Manufacturer: Analog Devices; Min Supply Voltage: 4.5V; Max Supply Voltage: 5.5V; Bandwidth: 100MHz; Slew Rate: 650V/µs; Number of Channels: 2; Operating Supply Voltage: 5V; Input Offset Voltage (Vos): 50mV; Power Supply Rejection Ratio (PSRR): 68dB; Voltage Gain: 19dB; Power Dissipation: 1.97W; Gain Bandwidth Product: 120MHz; Input Resistance: 6kR; Gain: 55dB; Operating Supply Current: 58mA; Noise Figure: 4.2dB; Supplier 1: Farnell; Manufacturer Part Number: AD8332ACPZ-R7; Stock 1: 0; Mount: Surface Mount; Case/Package: LFCSP EP; Number of Pins: 32; Contact Plating: Tin,Matte; Min Operating Temperature: -40°C; Max Operating Temperature: 85°C; Packaging: Tape and Reel; Package Quantity: 1; Number of Elements: 2; Number of Amplifiers: 2; -3db Bandwidth: 120MHz; Length: 5mm; Width: 5mm; Height: 0.8mm; Radiation Hardening: No; REACH SVHC: No SVHC; Lead Free: Contains Lead; ComponentLink1URL: http://www.mouser.com/ds/2/609/AD8331_8332_8334-877850.pdf?src-supplier=Mouser; ComponentLink1Description: http://www.mouser.com/ds/2/609/AD8331_8332_8334-877850.pdf?src-supplier=Mouser; ComponentLink2URL: http://www.analog.com/media/en/technical-documentation/data-sheets/AD8331_8332_8334.pdf?src-supplier=Digi-Key; ComponentLink2Description: http://www.analog.com/media/en/technical-documentation/data-sheets/AD8331_8332_8334.pdf?src-supplier=Digi-Key; ComponentLink3URL: http://www.analog.com/static/imported-files/data_sheets/AD8331_8332_8334.pdf?src-supplier=Avnet+Europe; ComponentLink3Description: http://www.analog.com/static/imported-files/data_sheets/AD8331_8332_8334.pdf?src-supplier=Avnet+Europe; ComponentLink4URL: http://www.analog.com/static/imported-files/data_sheets/AD8331_8332_8334.pdf?src-supplier=Avnet; ComponentLink4Description: http://www.analog.com/static/imported-files/data_sheets/AD8331_8332_8334.pdf?src-supplier=Avnet